# EAGLE design atmega8a (EAGLE 7.1.0)
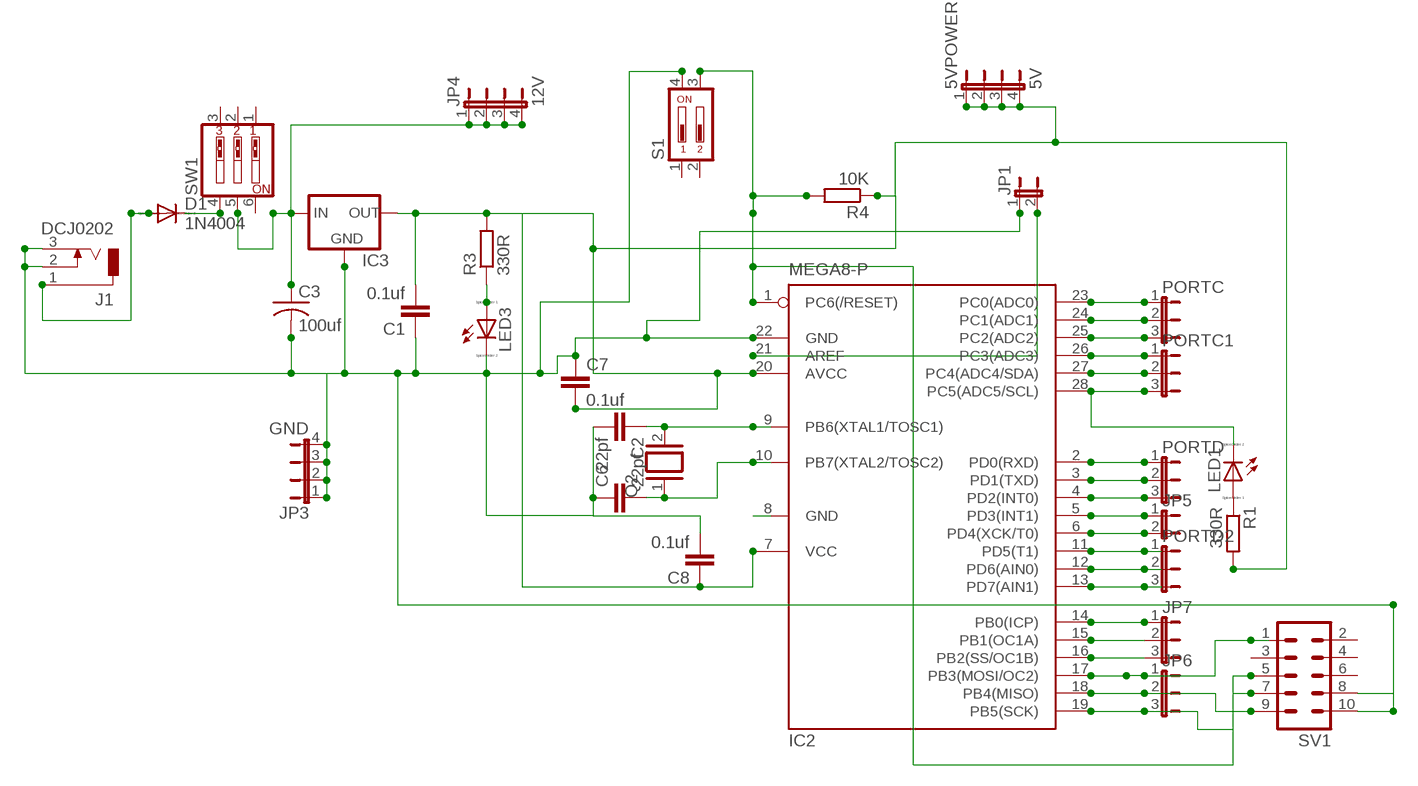
[diagram p0: schematic, sheet 1]

## Parts
5VPOWER  5V  JP4E  [JP4]
C1  0.1uf  C2,5-3  [C2.5-3]
C2  22pf  C2,5-3  [C2.5-3]
C3  100uf  C-US025-025X050  [C025-025X050]
C6  22pf  C2,5-3  [C2.5-3]
C7  0.1uf  C2,5-3  [C2.5-3]
C8  0.1uf  C2,5-3  [C2.5-3]
D1  1N4004  [DO41-10]
IC2  MEGA8-P  [DIL28-3]
IC3  78XXS  [78XXS]
J1  DCJ0202  [DCJ0202]
JP1  JP1E  [JP1]
JP3  GND  JP4E  [JP4]
JP4  12V  JP4E  [JP4]
JP5  JP1E  [JP1]
JP6  JP2W  [JP2W]
JP7  JP2W  [JP2W]
LED1  LED_ELD260  [LED_LD260]
LED3  LED_ELD260  [LED_LD260]
PORTC  JP2W  [JP2W]
PORTC1  JP2W  [JP2W]
PORTD  JP2W  [JP2W]
PORTD2  JP2W  [JP2W]
Q2  XTAL/S  [QS]
R1  330R  R-EU_0207/7  [0207/7]
R3  330R  R-EU_0207/7  [0207/7]
R4  10K  R-EU_0207/7  [0207/7]
S1  SD4-02  [SD4-02]
SV1  MA05-2  [MA05-2]
SW1  SW_DIP-3  [EDG-03]

## Nets
N$1: C3.1 IC3.IN JP4.1 JP4.2 JP4.3 JP4.4 SW1.5
N$2: LED1.A R1.1
N$3: D1.A J1.1
N$4: IC2.23(PC0(ADC0)) PORTC.1
N$5: IC2.24(PC1(ADC1)) PORTC.2
N$6: IC2.25(PC2(ADC2)) PORTC.3
N$7: IC2.8(GND)
N$10: IC2.26(PC3(ADC3)) PORTC1.1
N$15: D1.C SW1.4
N$17: LED3.A R3.1
N$19: C2.1 IC2.9(PB6(XTAL1/TOSC1)) Q2.2
N$20: C6.2 IC2.10(PB7(XTAL2/TOSC2)) Q2.1
N$21: 5VPOWER.1 5VPOWER.2 5VPOWER.3 5VPOWER.4 C1.2 C7.2 C8.1 IC2.7(VCC) IC2.20(AVCC) IC3.OUT R1.2 R3.2 R4.1
N$22: IC2.27(PC4(ADC4/SDA)) PORTC1.2
N$28: IC2.28(PC5(ADC5/SCL)) LED1.K(C) PORTC1.3
N$29: IC2.2(PD0(RXD)) PORTD.1
N$30: IC2.3(PD1(TXD)) PORTD.2
N$31: IC2.4(PD2(INT0)) PORTD.3
N$32: IC2.5(PD3(INT1)) JP5.1
N$33: IC2.6(PD4(XCK/T0)) JP5.2
N$34: IC2.14(PB0(ICP)) JP7.1
N$35: IC2.15(PB1(OC1A)) JP7.2
N$36: IC2.16(PB2(SS/OC1B)) JP7.3
N$37: IC2.17(PB3(MOSI/OC2)) JP6.1 SV1.1
N$38: IC2.18(PB4(MISO)) JP6.2 SV1.9
N$39: IC2.19(PB5(SCK)) JP6.3 SV1.7
N$41: C1.1 C2.2 C3.2 C6.1 C7.1 C8.2 IC2.22(GND) IC3.GND J1.2 J1.3 JP1.1 JP3.1 JP3.2 JP3.3 JP3.4 LED3.K(C) S1.4 SV1.8 SV1.10
N$42: IC2.1(PC6(/RESET)) R4.2 S1.3 SV1.5
N$43: IC2.11(PD5(T1)) PORTD2.1
N$44: IC2.12(PD6(AIN0)) PORTD2.2
N$45: IC2.13(PD7(AIN1)) PORTD2.3
N$46: IC2.21(AREF) JP1.2
Unconnected: S1.1 S1.2 SV1.2 SV1.3 SV1.4 SV1.6 SW1.1 SW1.2 SW1.3 SW1.6

## Library data of the parts
5VPOWER JP3 JP4 = jumper:JP4E: JUMPER
C1 C2 C6-C8 = capacitor-wima:C: CAPACITOR naming: grid - package width
C3 = resistor:C-US: CAPACITOR, American symbol
D1 = diode:1N4004: DIODE general purpose rectifier, 1 A
IC2 = atmel:MEGA8-P: MICROCONTROLLER 8 Kbytes FLASH, 1 kbytes SRAM, 512 bytes EEPROM, USART, 4-channel 10 bit ADC, 2-channel 8 bit ADC Pin compatible with Atmega48, ATMega88, ATMega168 Source: avr.lbr; OC_FARNELL: unknown; OC_NEWARK: unknown
IC3 = v-reg:78XXS: VOLTAGE REGULATOR
J1 = con-jack:DCJ0202: DC POWER JACK Source: DCJ0202.pdf; OC_FARNELL: unknown; OC_NEWARK: unknown
JP1 JP5 = jumper:JP1E: JUMPER
JP6 JP7 PORTC PORTC1 PORTD PORTD2 = jumper:JP2W: JUMPER
LED1 LED3 = eagle-ltspice:LED_E: LED Source: http://www.osram.convergy.de Source: www.luxeon.com Source: www.kingbright.com; SPICEMODEL: NONE; SPICEPREFIX: D; SPICETYPE: diode
Q2 = special:XTAL/S: CRYSTAL
R1 R3 R4 = rcl:R-EU_: RESISTOR, European symbol
S1 = switch-dil:SD4-02: DIL/CODE SWITCH; OC_FARNELL: unknown; OC_NEWARK: unknown
SV1 = con-lstb:MA05-2: PIN HEADER; OC_FARNELL: unknown; OC_NEWARK: unknown
SW1 = special:SW_DIP-3: DIP SWITCH

## Board
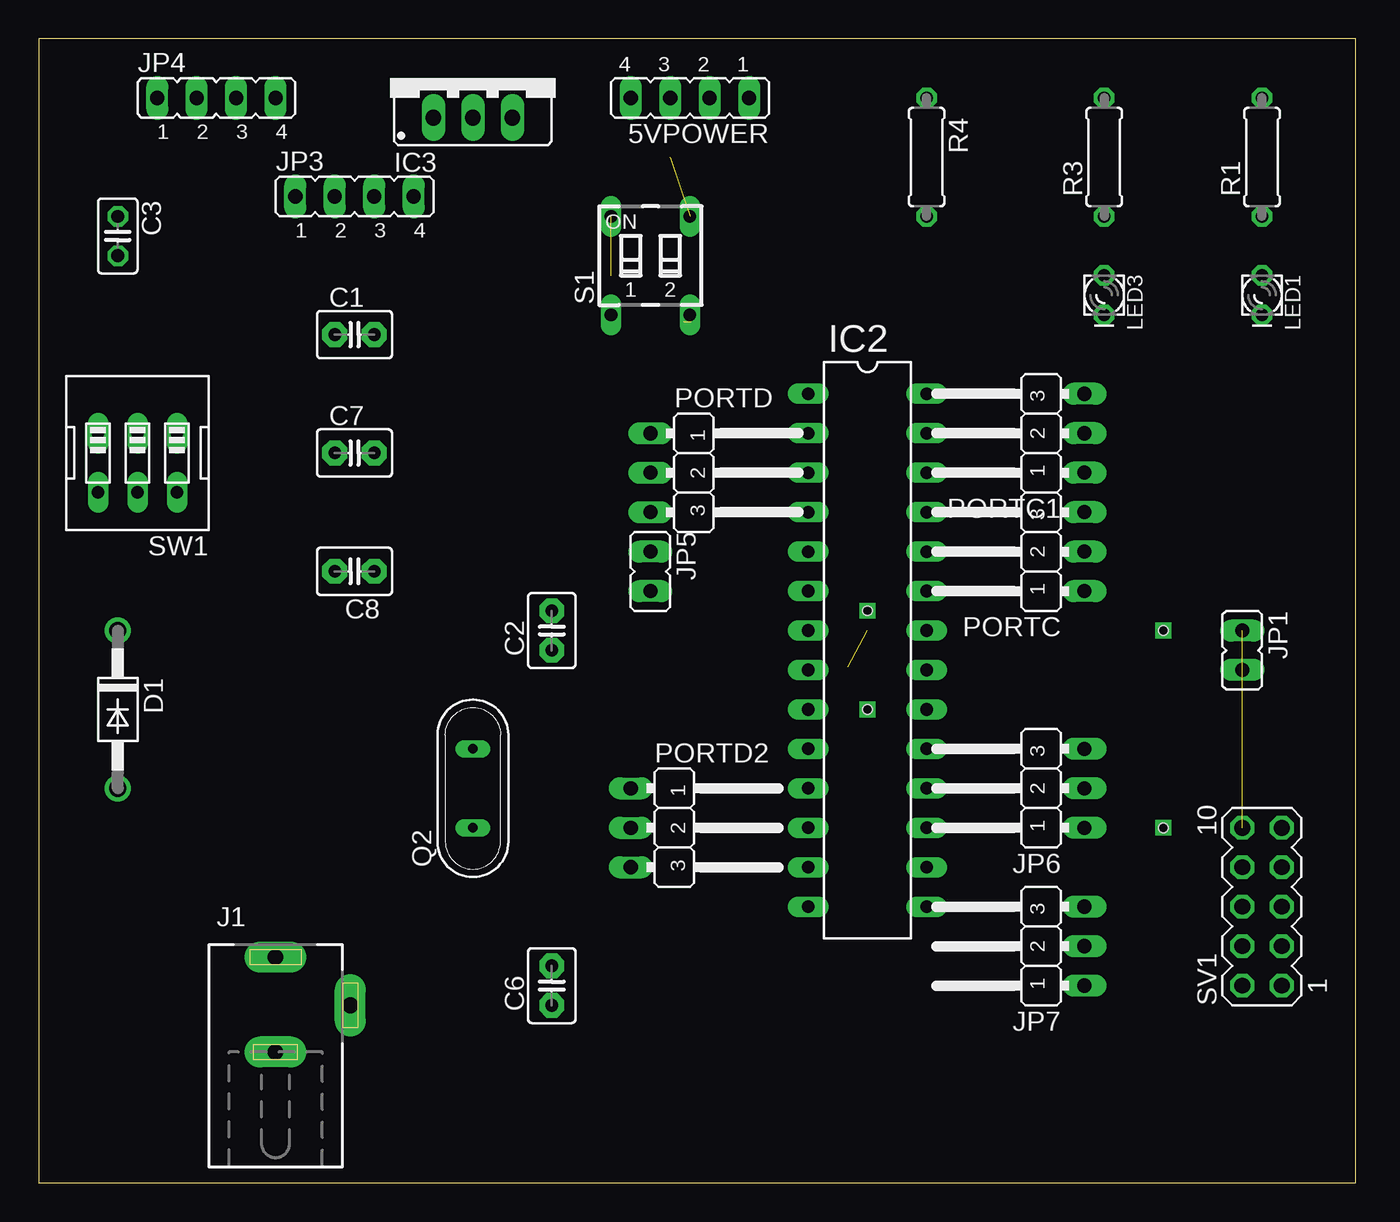
[diagram p1: board, top side]
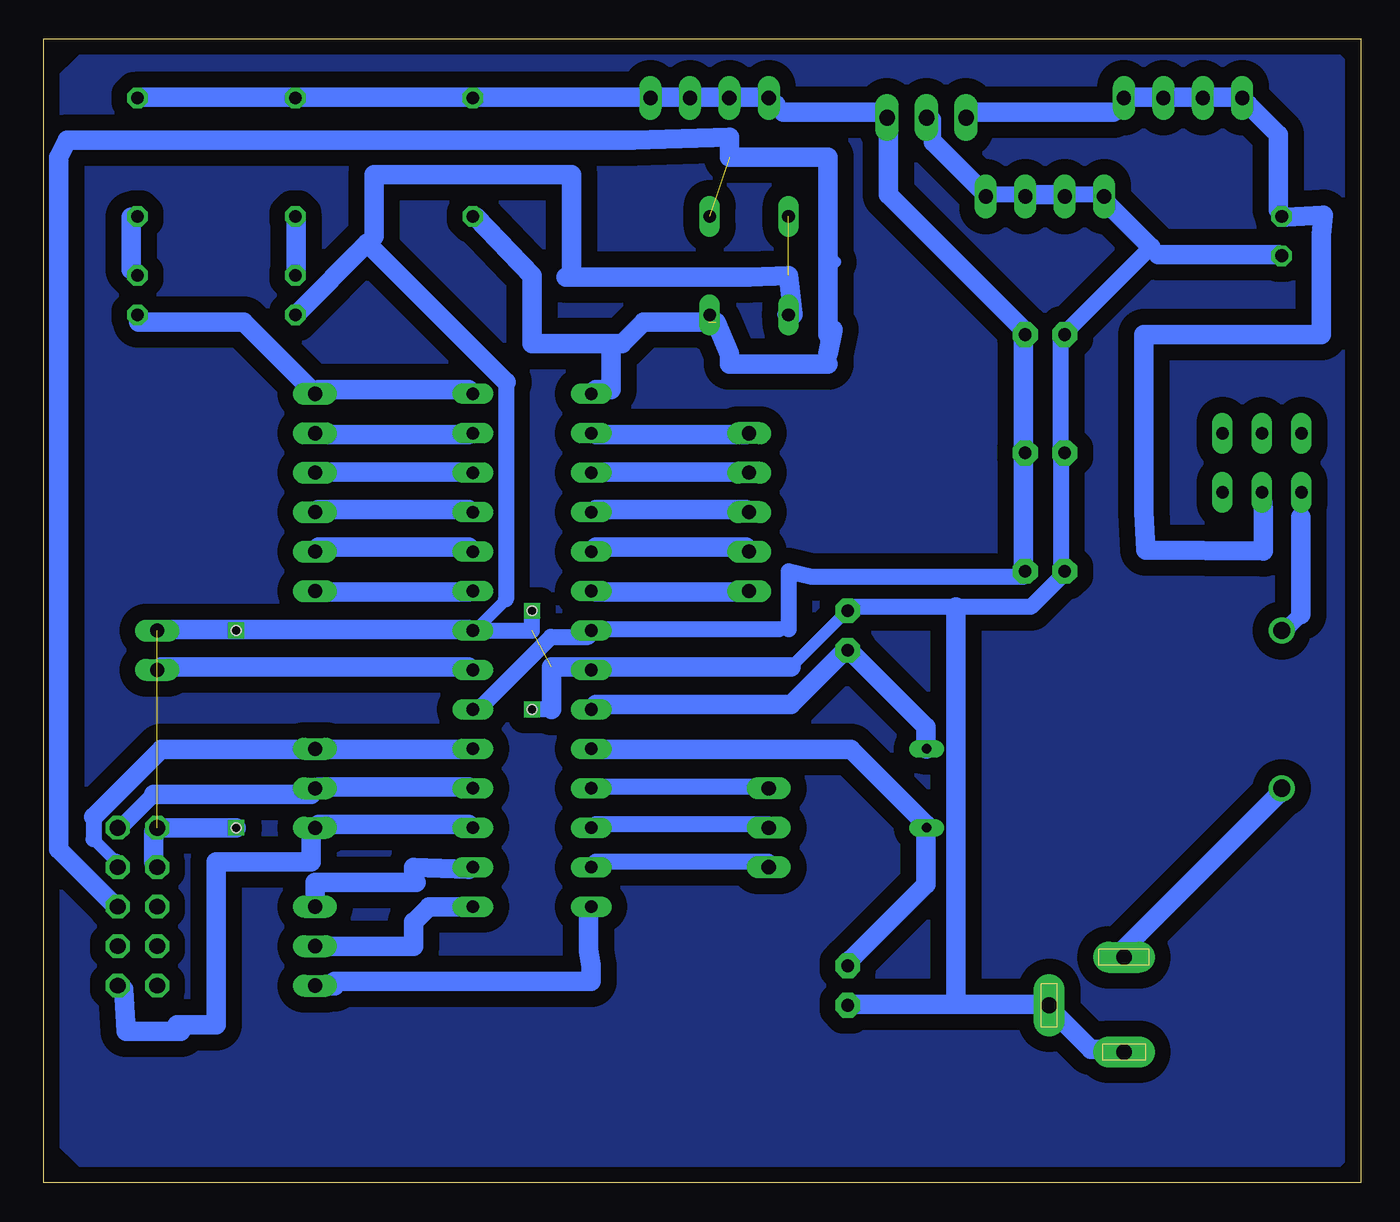
[diagram p2: board, bottom side, seen from below]

Size 84.76 x 73.65 mm. Coordinates in mm from the lower left corner, seen from the top.
Outline: 0,0 84.76,0 84.76,73.65 0,73.65 0,0
Copper layers (1*16): Top 0.035mm / dielectric 1.5mm / Bottom 0.035mm
Design rules "default *": minimum track width 30mil, minimum drill 24mil, track to track 8mil, track to pad 8mil, pad to pad 8mil, via to via 8mil, smd to smd 8mil, copper to edge 40mil, drill to drill 8mil, minimum pad ring 10mil, minimum via ring 8mil, stop-mask expansion 4mil, vias tented up to drill 0mil, thermal gap 10mil
Holes 0.6 mm at 72.39,35.56 72.39,22.86 53.34,30.48 53.34,36.83

### Footprints (pad centres in the part's own frame; a part is rotated, then mirrored left to right if it is on the bottom)
JP4 = drill 0.914 long: 1 -3.81,0; 2 -1.27,0; 3 1.27,0; 4 3.81,0
C2.5-3 = drill 0.813 pad 1.6 octagon: 1 -1.27,0; 2 1.27,0
C025-025X050 = drill 0.813 octagon: 1 -1.27,0; 2 1.27,0
DO41-10 = drill 1.118: A 5.08,0; C -5.08,0
DIL28-3 = drill 0.813 long: 1 -16.51,-3.81; 2 -13.97,-3.81; 3 -11.43,-3.81; 4 -8.89,-3.81; 5 -6.35,-3.81; 6 -3.81,-3.81; 7 -1.27,-3.81; 8 1.27,-3.81; 9 3.81,-3.81; 10 6.35,-3.81; 11 8.89,-3.81; 12 11.43,-3.81; 13 13.97,-3.81; 14 16.51,-3.81; 15 16.51,3.81; 16 13.97,3.81; 17 11.43,3.81; 18 8.89,3.81; 19 6.35,3.81; 20 3.81,3.81; 21 1.27,3.81; 22 -1.27,3.81; 23 -3.81,3.81; 24 -6.35,3.81; 25 -8.89,3.81; 26 -11.43,3.81; 27 -13.97,3.81; 28 -16.51,3.81
78XXS = drill 1.016 long: GND 0,-2.54; IN -2.54,-2.54; OUT 2.54,-2.54
DCJ0202 = drill 1 pad 2 long: 1 0,3.1; 2 4.8,0; 3 0,-3
JP1 = drill 0.914 long: 1 0,-1.27; 2 0,1.27
JP2W = drill 0.914 long: 1 -2.54,-1.27; 2 0,-1.27; 3 2.54,-1.27
LED_LD260 = drill 0.813 octagon: A -1.27,0; K 1.27,0
QS = drill 0.61 long: 1 -2.54,0; 2 2.54,0
0207/7 = drill 0.813 octagon: 1 -3.81,0; 2 3.81,0
SD4-02 = drill 0.813 long: 1 -2.54,-3.81; 2 2.54,-3.81; 3 2.54,2.54; 4 -2.54,2.54
MA05-2 = drill 1.016 octagon: 1 -5.08,-1.27; 2 -5.08,1.27; 3 -2.54,-1.27; 4 -2.54,1.27; 5 0,-1.27; 6 0,1.27; 7 2.54,-1.27; 8 2.54,1.27; 9 5.08,-1.27; 10 5.08,1.27
EDG-03 = drill 0.813 long: 1 -2.54,-1.27; 2 0,-1.27; 3 2.54,-1.27; 4 2.54,2.54; 5 0,2.54; 6 -2.54,2.54

### Placement (x,y rotation side)
5VPOWER  41.91,69.85 180 top
C1  20.32,54.61 0 top
C2  33.02,35.56 90 top
C3  5.08,60.96 270 top
C6  33.02,12.7 90 top
C7  20.32,46.99 0 top
C8  20.32,39.37 180 top
D1  5.08,30.48 270 top
IC2  53.34,34.29 270 top
IC3  27.94,71.12 0 top
J1  15.24,11.43 0 top
JP1  77.47,34.29 180 top
JP3  20.32,63.5 0 top
JP4  11.43,69.85 0 top
JP5  39.37,39.37 180 top
JP6  66.04,25.4 90 top
JP7  66.04,15.24 90 top
LED1  78.74,57.15 270 top
LED3  68.58,57.15 270 top
PORTC  66.04,40.64 90 top
PORTC1  66.04,48.26 90 top
PORTD  40.64,45.72 270 top
PORTD2  39.37,22.86 270 top
Q2  27.94,25.4 90 top
R1  78.74,66.04 90 top
R3  68.58,66.04 90 top
R4  57.15,66.04 270 top
S1  39.37,59.69 0 top
SV1  78.74,17.78 90 top
SW1  6.35,46.99 180 top

### Tracks (layer width: path | path; a pad name or v marks a point on that pad's centre or on a via)
N$1
  Bottom 0.762: 10.62,69.9 JP4.2 | 12.55,69.9 JP4.3 13.03,69.9 | 14.96,69.9 JP4.4 15.44,69.42 15.93,68.94 | 25.09,68.94 IC3.IN | 5.31,62.66 C3.1 4.83,62.18 | 7.24,69.42 JP4.1 7.72,69.9
  Bottom 1.27: 12.55,69.9 10.62,69.9 | 13.03,69.9 14.96,69.9 | 15.93,68.94 25.09,68.94 | 5.31,62.66 5.31,67.49 7.24,69.42 | 4.83,62.18 2.41,62.31 2.54,61.04 2.54,54.61 13.97,54.61 13.97,43.18 13.84,40.74 6.27,40.69 6.27,43.36 SW1.5 | 7.72,69.9 10.13,69.9 JP4.2
N$2
  Bottom 0.762: 79.15,58.8 LED1.A | 79.15,62.18 R1.1
  Bottom 1.27: 79.15,62.18 79.15,58.8
N$3
  Bottom 0.762: 5.31,25.02 D1.A | 15.44,14.88 J1.1
  Bottom 1.27: 15.44,14.88 5.31,25.02
N$4
  Bottom 0.762: 57.43,38.05 IC2.23 | 67.08,38.05 PORTC.1
  Bottom 1.27: 67.08,38.05 57.43,38.05
N$5
  Bottom 0.762: 57.43,40.95 IC2.24 | 67.08,40.95 PORTC.2
  Bottom 1.27: 67.08,40.95 57.43,40.95
N$6
  Bottom 0.762: 57.43,43.36 IC2.25 | 67.08,43.36 PORTC.3
  Bottom 1.27: 67.08,43.36 57.43,43.36
N$8  (via drill 0.6)
  other vias: 53.34,30.48
N$9  (via drill 0.6)
  other vias: 53.34,36.83
N$10
  Bottom 0.762: 57.43,45.77 IC2.26 | 67.08,45.77 PORTC1.1
  Bottom 1.27: 67.08,45.77 57.43,45.77
N$11  (via drill 0.6)
  other vias: 72.39,22.86
N$12  (via drill 0.6)
  other vias: 72.39,35.56
N$13
  pour Bottom (isolate 1.016, rank 2): 2.54,0 0,2.54 0,71.12 2.54,73.66 81.28,73.66 85.09,69.85 85.09,3.81 81.28,0
N$15
  Bottom 0.762: 3.86,42.88 SW1.4
  Bottom 1.016: 4.83,35.64 3.86,36.6
  Bottom 1.27: 3.86,36.6 3.86,42.88 | 4.83,35.64 D1.C
N$17
  Bottom 0.762: 68.53,58.8 LED3.A | 68.53,62.18 R3.1
  Bottom 1.27: 68.53,62.18 68.53,58.8
N$19
  Bottom 0.762: 32.82,34.19 C2.1 33.3,34.19 | 49.23,30.81 IC2.9
  Bottom 1.27: 32.82,34.19 27.99,29.36 27.99,28.4 Q2.2 | 49.23,30.81 36.68,30.81 33.3,34.19
N$20
  Bottom 0.762: 27.99,22.61 Q2.1 27.99,23.09 | 32.82,14.4 C6.2 | 49.23,27.91 IC2.10
  Bottom 1.27: 27.99,22.61 27.99,19.23 32.82,14.4 | 49.23,27.91 32.82,27.91 27.99,23.09
N$21
  Bottom 0.762: 43.43,69.9 5VPOWER.2 42.95,69.9 | 45.36,69.9 5VPOWER.1 45.85,69.9 | 38.12,69.9 5VPOWER.4 | 40.54,69.9 5VPOWER.3 41.02,69.9 | 37.64,69.42 37.16,68.94 | 30.89,68.94 IC3.OUT 30.4,68.45 | 57.43,69.9 R4.1 56.95,69.9 | 68.53,69.9 R3.2 69.01,69.9 | 78.66,69.9 R1.2 | 49.71,35.15 IC2.7 49.23,35.64 | 56.95,30.33 IC2.20 | 21.72,39.5 C8.1 21.72,39.01 | 21.72,46.74 C7.2 21.72,47.22 | 21.72,54.46 C1.2 21.72,54.94 | 36.83,35.64 37.47,35.64
  Bottom 1.016: 49.71,35.15 52.12,35.15 56.95,30.33 | 37.47,35.64 49.23,35.64 | 36.83,35.64 36.83,39.37 35.36,39.01 21.72,39.01
  Bottom 1.27: 45.36,69.9 43.43,69.9 | 40.54,69.9 38.12,69.9 | 37.16,68.94 30.89,68.94 | 37.64,69.42 5VPOWER.4 | 41.02,69.9 42.95,69.9 | 68.53,69.9 57.43,69.9 | 69.01,69.9 78.66,69.9 | 56.95,69.9 45.85,69.9 | 21.72,46.74 21.72,39.5 | 21.72,47.22 21.72,54.46 | 30.4,68.45 30.4,63.63 21.72,54.94
N$22
  Bottom 0.762: 57.43,48.18 IC2.27 | 67.08,48.18 PORTC1.2
  Bottom 1.27: 67.08,48.18 57.43,48.18
N$28
  Bottom 0.762: 57.43,51.08 IC2.28 | 67.08,51.08 PORTC1.3 67.56,51.08 | 78.66,55.42 LED1.K
  Bottom 1.27: 67.08,51.08 57.43,51.08 | 78.66,55.42 71.91,55.42 67.56,51.08
N$29
  Bottom 0.762: 49.23,48.18 IC2.2 | 39.57,48.18 PORTD.1
  Bottom 1.27: 39.57,48.18 49.23,48.18
N$30
  Bottom 0.762: 49.23,45.77 IC2.3 | 39.57,45.77 PORTD.2
  Bottom 1.27: 39.57,45.77 49.23,45.77
N$31
  Bottom 0.762: 49.23,43.36 IC2.4 | 39.57,43.36 PORTD.3
  Bottom 1.27: 39.57,43.36 49.23,43.36
N$32
  Bottom 0.762: 49.23,40.95 IC2.5 | 39.57,40.95 JP5.1
  Bottom 1.27: 39.57,40.95 49.23,40.95
N$33
  Bottom 0.762: 49.23,38.05 IC2.6 | 39.57,38.05 JP5.2
  Bottom 1.27: 39.57,38.05 49.23,38.05
N$34
  Bottom 0.762: 49.71,17.78 IC2.14
  Bottom 1.27: 49.71,17.78 49.71,14.96 49.53,13.97 49.53,12.98 66.04,12.98 66.04,12.7 JP7.1
N$35
  Bottom 0.762: 57.43,17.78 IC2.15 | 60.94,16.79 60.96,16.79
  Bottom 1.27: 57.43,17.78 59.97,17.76 60.94,16.79 | 60.96,16.79 60.96,15.24 JP7.2
N$36
  Bottom 0.762: 57.43,20.19 IC2.16
  Bottom 1.27: 57.43,20.19 60.96,20.32 60.96,19.35 60.81,19.35 65.89,19.33 67.31,19.33 67.31,19.05 JP7.3
N$37
  Bottom 0.762: 57.43,23.09 IC2.17 | 67.08,23.09 JP6.1 67.56,22.61
  Bottom 1.016: 79.63,12.47 SV1.1
  Bottom 1.27: 67.08,23.09 57.43,23.09 | 79.63,12.47 79.45,9.75 75.95,9.75 76.2,10.16 73.66,10.16 73.66,20.68 67.56,20.68 67.56,22.61
N$38
  Bottom 0.762: 57.43,25.5 IC2.18 | 67.08,25.5 JP6.2 67.56,25.02 | 79.63,23.09 SV1.9
  Bottom 1.016: 77.7,25.02 79.63,23.09
  Bottom 1.27: 67.08,25.5 57.43,25.5 | 67.56,25.02 77.7,25.02
N$39
  Bottom 0.762: 57.43,27.91 IC2.19 | 67.08,27.91 JP6.3 67.56,27.91 | 81.56,22.12 80.11,20.68
  Bottom 1.016: 81.56,23.57 81.56,22.12 | 80.11,20.68 SV1.7
  Bottom 1.27: 67.08,27.91 57.43,27.91 | 81.56,23.57 77.22,27.91 67.56,27.91
N$41  (3 unrouted)
  Bottom 0.406: JP1.1 72.39,35.56
  Bottom 0.762: 57.43,35.64 IC2.22 56.95,35.64 55.02,37.57 | 77.22,35.64 JP1.1 | 36.55,55.91 37.16,55.91 | 50.8,58.42 51.16,58.32 | 63.94,60.49 63.5,60.96 | 68.53,55.91 LED3.K | 77.7,22.61 SV1.10 | 32.82,11.51 C6.1 | 20.27,11.51 J1.2 19.79,11.02 | 36.68,33.22 33.3,36.6 C2.2 32.82,37.08 | 19.3,39.5 C8.2 19.3,39.01 | 19.3,46.74 C7.1 19.3,47.22 | 19.3,54.46 C1.1 18.82,54.94 | 21.72,63.63 JP3.3 | 27.51,68.45 IC3.GND | 24.13,63.63 JP3.4 | 13.51,60.25 13.03,59.77 | 5.31,59.77 C3.2 | 18.82,63.63 JP3.2 | 16.89,63.63 JP3.1
  Bottom 1.016: 55.02,51.56 55.02,37.57 | 15.44,8.61 J1.3 | 19.3,46.74 19.3,39.5 | 19.3,47.22 19.3,54.46 | 19.3,63.63 JP3.2 | 21.23,63.63 JP3.3 | 21.72,63.63 24.13,63.63 | 27.51,67.01 27.51,68.45 | 16.89,63.63 18.82,63.63 | 13.51,60.25 18.82,54.94 | 32.82,37.08 26.06,37.08 21.23,37.08 19.3,39.01 | 52.07,30.48 53.34,30.48 | IC2.22 53.34,35.56 53.34,36.83
  Bottom 1.27: 77.22,35.64 57.43,35.64 | 36.55,55.91 36.83,58.42 39.37,58.32 51.16,58.32 | 50.8,58.42 50.8,64.9 63.5,64.9 63.5,60.96 | 68.53,55.91 63.94,60.49 55.02,51.56 | 77.7,22.61 77.7,20.68 SV1.8 | 20.27,11.51 26.06,11.51 | 26.06,11.51 32.82,11.51 | 15.44,8.61 17.37,8.61 19.79,11.02 | 36.68,33.22 52.07,33.22 52.07,30.48 | 21.23,63.63 19.3,63.63 | 24.13,63.63 27.51,67.01 | 13.03,59.77 5.31,59.77 | 13.51,60.25 16.41,63.14 JP3.1 | 26.06,37.08 26.06,11.51 | SV1.10 72.39,22.86
N$42  (2 unrouted)
  Bottom 0.762: 48.26,53.34 47.54,54.04 | 49.23,51.08 IC2.1 | 56.95,62.18 R4.2 | 34.29,59.69 33.83,59.28 33.96,59.41 34.29,59.41 | 33.96,54.94 34.29,54.61 | 34.29,52.7 34.29,53.34 | 80.11,17.78 SV1.5
  Bottom 1.27: 41.99,55.42 46.15,55.42 47.54,54.04 53.34,54.04 53.34,58.42 56.95,62.18 | 49.23,51.08 48.26,51.08 48.26,53.34 | 80.11,17.78 83.8,21.46 83.8,60.25 83.82,60.25 83.82,66.04 83.26,67.13 46.81,67.13 40.64,67.31 40.64,66.04 34.29,66.04 34.29,59.69 | 34.29,54.61 34.29,59.41 | 34.29,53.34 33.96,54.94 | 34.29,52.7 40.64,52.7 40.64,53.34 41.5,55.42
N$43
  Bottom 0.762: 49.23,25.5 IC2.11 | 38.12,25.5 PORTD2.1
  Bottom 1.016: 38.12,25.5 49.23,25.5
N$44
  Bottom 0.762: 49.23,23.09 IC2.12 | 38.12,23.09 PORTD2.2
  Bottom 1.016: 38.12,23.09 49.23,23.09
N$45
  Bottom 0.762: 49.23,20.68 IC2.13 | 38.12,20.68 PORTD2.3
  Bottom 1.016: 38.12,20.68 49.23,20.68
N$46
  Bottom 0.762: 57.43,33.22 IC2.21 | 77.22,33.22 JP1.2
  Bottom 1.27: 77.22,33.22 57.43,33.22